# Altium schematic sheet Sheet1.SchDoc
size A4
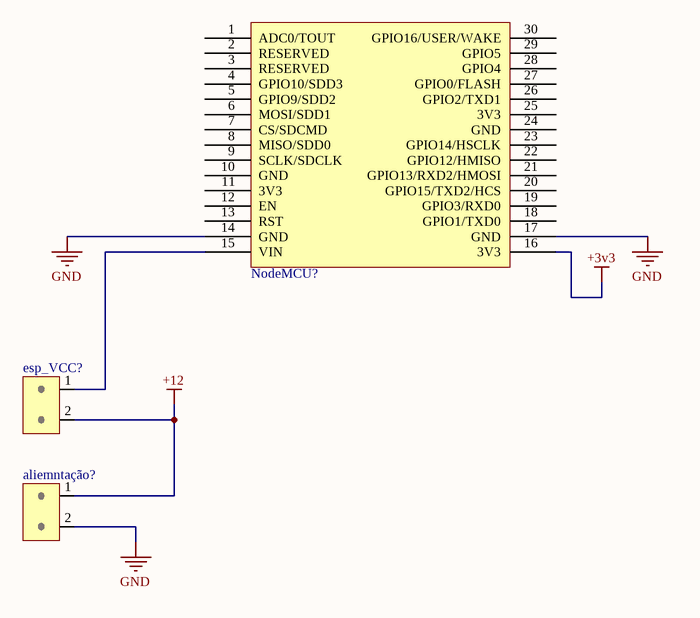
[diagram p0: Sheet1.SchDoc]

## Parts
aliemntação?  ?  [CN_KRE_2]  (value not drawn)
esp_VCC?  ?  [HEADER_1X2]  (value not drawn)
NodeMCU?  ESP8266 Development kit  [DIV_NodeMCU_Socket]  (value not drawn)

## Nets
+3v3: NodeMCU?.16(3V3)
+12: aliemntação?.1 esp_VCC?.2
GND: aliemntação?.2 NodeMCU?.14(GND) NodeMCU?.17(GND)
Netesp_VCC?_1: esp_VCC?.1 NodeMCU?.15(VIN)

Not connected (* = marked no-connect by the designer): NodeMCU? 1(ADC0/TOUT) 2(RESERVED) 3(RESERVED) 4(GPIO10/SDD3) 5(GPIO9/SDD2) 6(MOSI/SDD1) 7(CS/SDCMD) 8(MISO/SDD0) 9(SCLK/SDCLK) 10(GND) 11(3V3) 12(EN) 13(RST) 18(GPIO1/TXD0) 19(GPIO3/RXD0) 20(GPIO15/TXD2/HCS) 21(GPIO13/RXD2/HMOSI) 22(GPIO12/HMISO) 23(GPIO14/HSCLK) 24(GND) 25(3V3) 26(GPIO2/TXD1) 27(GPIO0/FLASH) 28(GPIO4) 29(GPIO5) 30(GPIO16/USER/WAKE)

## Library data of the parts
aliemntação? esp_VCC? = CN_MKDS_2: MKDS_2; Value: ?
NodeMCU? = NodeMCU: Reference: https://bennthomsen.files.wordpress.com/2015/12/nodemcu_pinout_700-2.png; Schematic: https://raw.githubusercontent.com/nodemcu/nodemcu-devkit/master/Documents/NODEMCU_DEVKIT_SCH.png